# EAGLE schematic untitled (EAGLE 9.6.1)
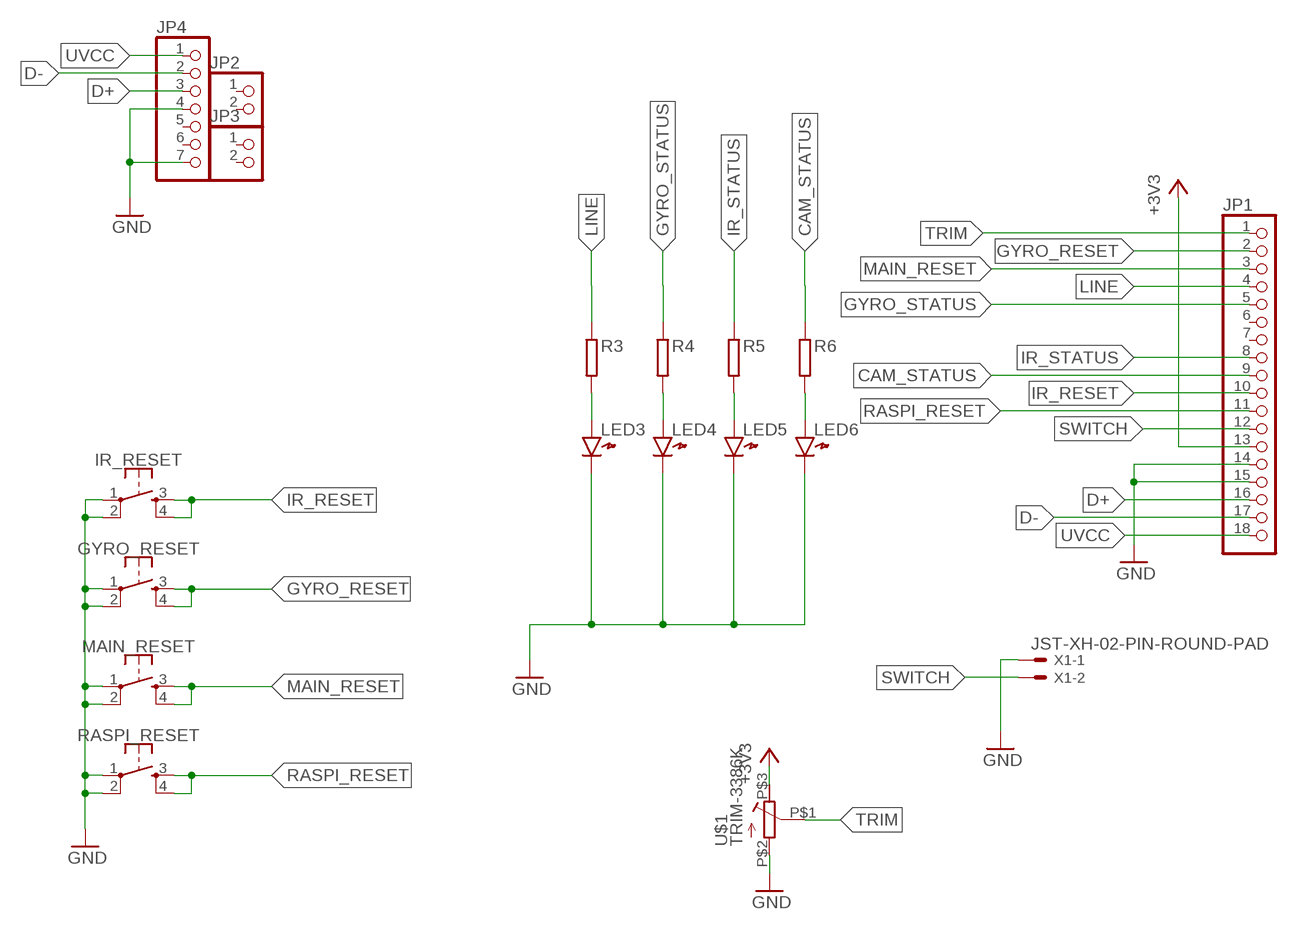
[diagram p0: schematic, sheet 1]

## Parts
GYRO_RESET  MOMENTARY-SWITCH-SPST-2-SMD-5.2MM  [TACTILE_SWITCH_SMD_5.2MM]
IR_RESET  MOMENTARY-SWITCH-SPST-2-SMD-5.2MM  [TACTILE_SWITCH_SMD_5.2MM]
JP1  PINHD-1X18  [1X18]
JP2  PINHD-1X2  [1X02]
JP3  PINHD-1X2  [1X02]
JP4  PINHD-1X7  [1X07]
LED3  LED1608  [LED1608]
LED4  LED1608  [LED1608]
LED5  LED1608  [LED1608]
LED6  LED1608  [LED1608]
MAIN_RESET  MOMENTARY-SWITCH-SPST-2-SMD-5.2MM  [TACTILE_SWITCH_SMD_5.2MM]
R3  RESISTOR1608  [SMD1608]
R4  RESISTOR1608  [SMD1608]
R5  RESISTOR1608  [SMD1608]
R6  RESISTOR1608  [SMD1608]
RASPI_RESET  MOMENTARY-SWITCH-SPST-2-SMD-5.2MM  [TACTILE_SWITCH_SMD_5.2MM]
U$1  TRIM-3386K  [TRIM-3386K]
X1  JST-XH-02-PIN-ROUND-PAD  [JST-XH-02-PACKAGE-ROUND-PAD]

## Nets
+3V3: JP1.13 U$1.P$3
CAM_STATUS: JP1.9 R6.1
D+: JP1.16 JP4.3
D-: JP1.17 JP4.2
GND: GYRO_RESET.1 GYRO_RESET.2 IR_RESET.1 IR_RESET.2 JP1.14 JP1.15 JP4.4 JP4.7 LED3.K LED4.K LED5.K LED6.K MAIN_RESET.1 MAIN_RESET.2 RASPI_RESET.1 RASPI_RESET.2 U$1.P$2 X1.1
GYRO_RESET: GYRO_RESET.3 GYRO_RESET.4 JP1.2
GYRO_STATUS: JP1.5 R4.1
IR_RESET: IR_RESET.3 IR_RESET.4 JP1.10
IR_STATUS: JP1.8 R5.1
LINE: JP1.4 R3.1
MAIN_RESET: JP1.3 MAIN_RESET.3 MAIN_RESET.4
N$3: LED3.A R3.2
N$4: LED4.A R4.2
N$5: LED5.A R5.2
N$6: LED6.A R6.2
RASPI_RESET: JP1.11 RASPI_RESET.3 RASPI_RESET.4
SWITCH: JP1.12 X1.2
TRIM: JP1.1 U$1.P$1
UVCC: JP1.18 JP4.1
Unconnected: JP1.6 JP1.7 JP2.1 JP2.2 JP3.1 JP3.2 JP4.5 JP4.6

## Library data of the parts
GYRO_RESET IR_RESET MAIN_RESET RASPI_RESET = SparkFun-Switches:MOMENTARY-SWITCH-SPST-2: Momentary Switch (Pushbutton) - SPST - Two Circuits Normally-open (NO) SPST momentary switches (buttons, pushbuttons). Schematic symbol includes two switch circuits. Variants SMD-4.6MMX2.8MM - 4.60mm x 2.80mm Tactile Momentary Button Switch - Used on SparkFun Pro Micro - RP2040 <https://www.sparkfun.com/products/17717> SMD-5.2MM - Mini Pushbutton Switch - SMD <https://www.sparkfun.com/products/8720> - Used on Arduino Pro Mini <https://www.sparkfun.com/products/11114>; PROD_ID: SWCH-08247; SF_SKU: COM-08720
JP1 = pinhead:PINHD-1X18: PIN HEADER
JP2 JP3 = pinhead:PINHD-1X2: PIN HEADER
JP4 = pinhead:PINHD-1X7: PIN HEADER
LED3-LED6 = generic:LED: Generic LEDs
R3-R6 = generic:RESISTOR: Generic Registor
U$1 = R-trim:TRIM-3386K
X1 = Rembrandt Electronics - JST XH Connectors v1-0:JST-XH-02-PIN: JST XH Connector 2 Pin Wire to board connector. Pitch: 2,54 mm, (0.100") Number of pins: 2 Created by Rembrandt Electronics www.rembrandtelectronics.com